# EasyEDA Pro project IMU Module.epro

# Schematic Schematic1
Assembly Variant: Basic; Board Name: Board1; Create Date: 2026-03-11; Page Name: P1; Project Name: arm_angles; Schematic Name: Schematic1; Update Date: 2026-03-11; BladeWidth: 10; Company: 嘉立创EDA; Page Size: A4; RegionStart: 1; ShowBorder: 1; TitleBlock: 1; TitleBlockPosition: 3; Version: V1.0; XRegionCount: 6; YRegionCount: 4
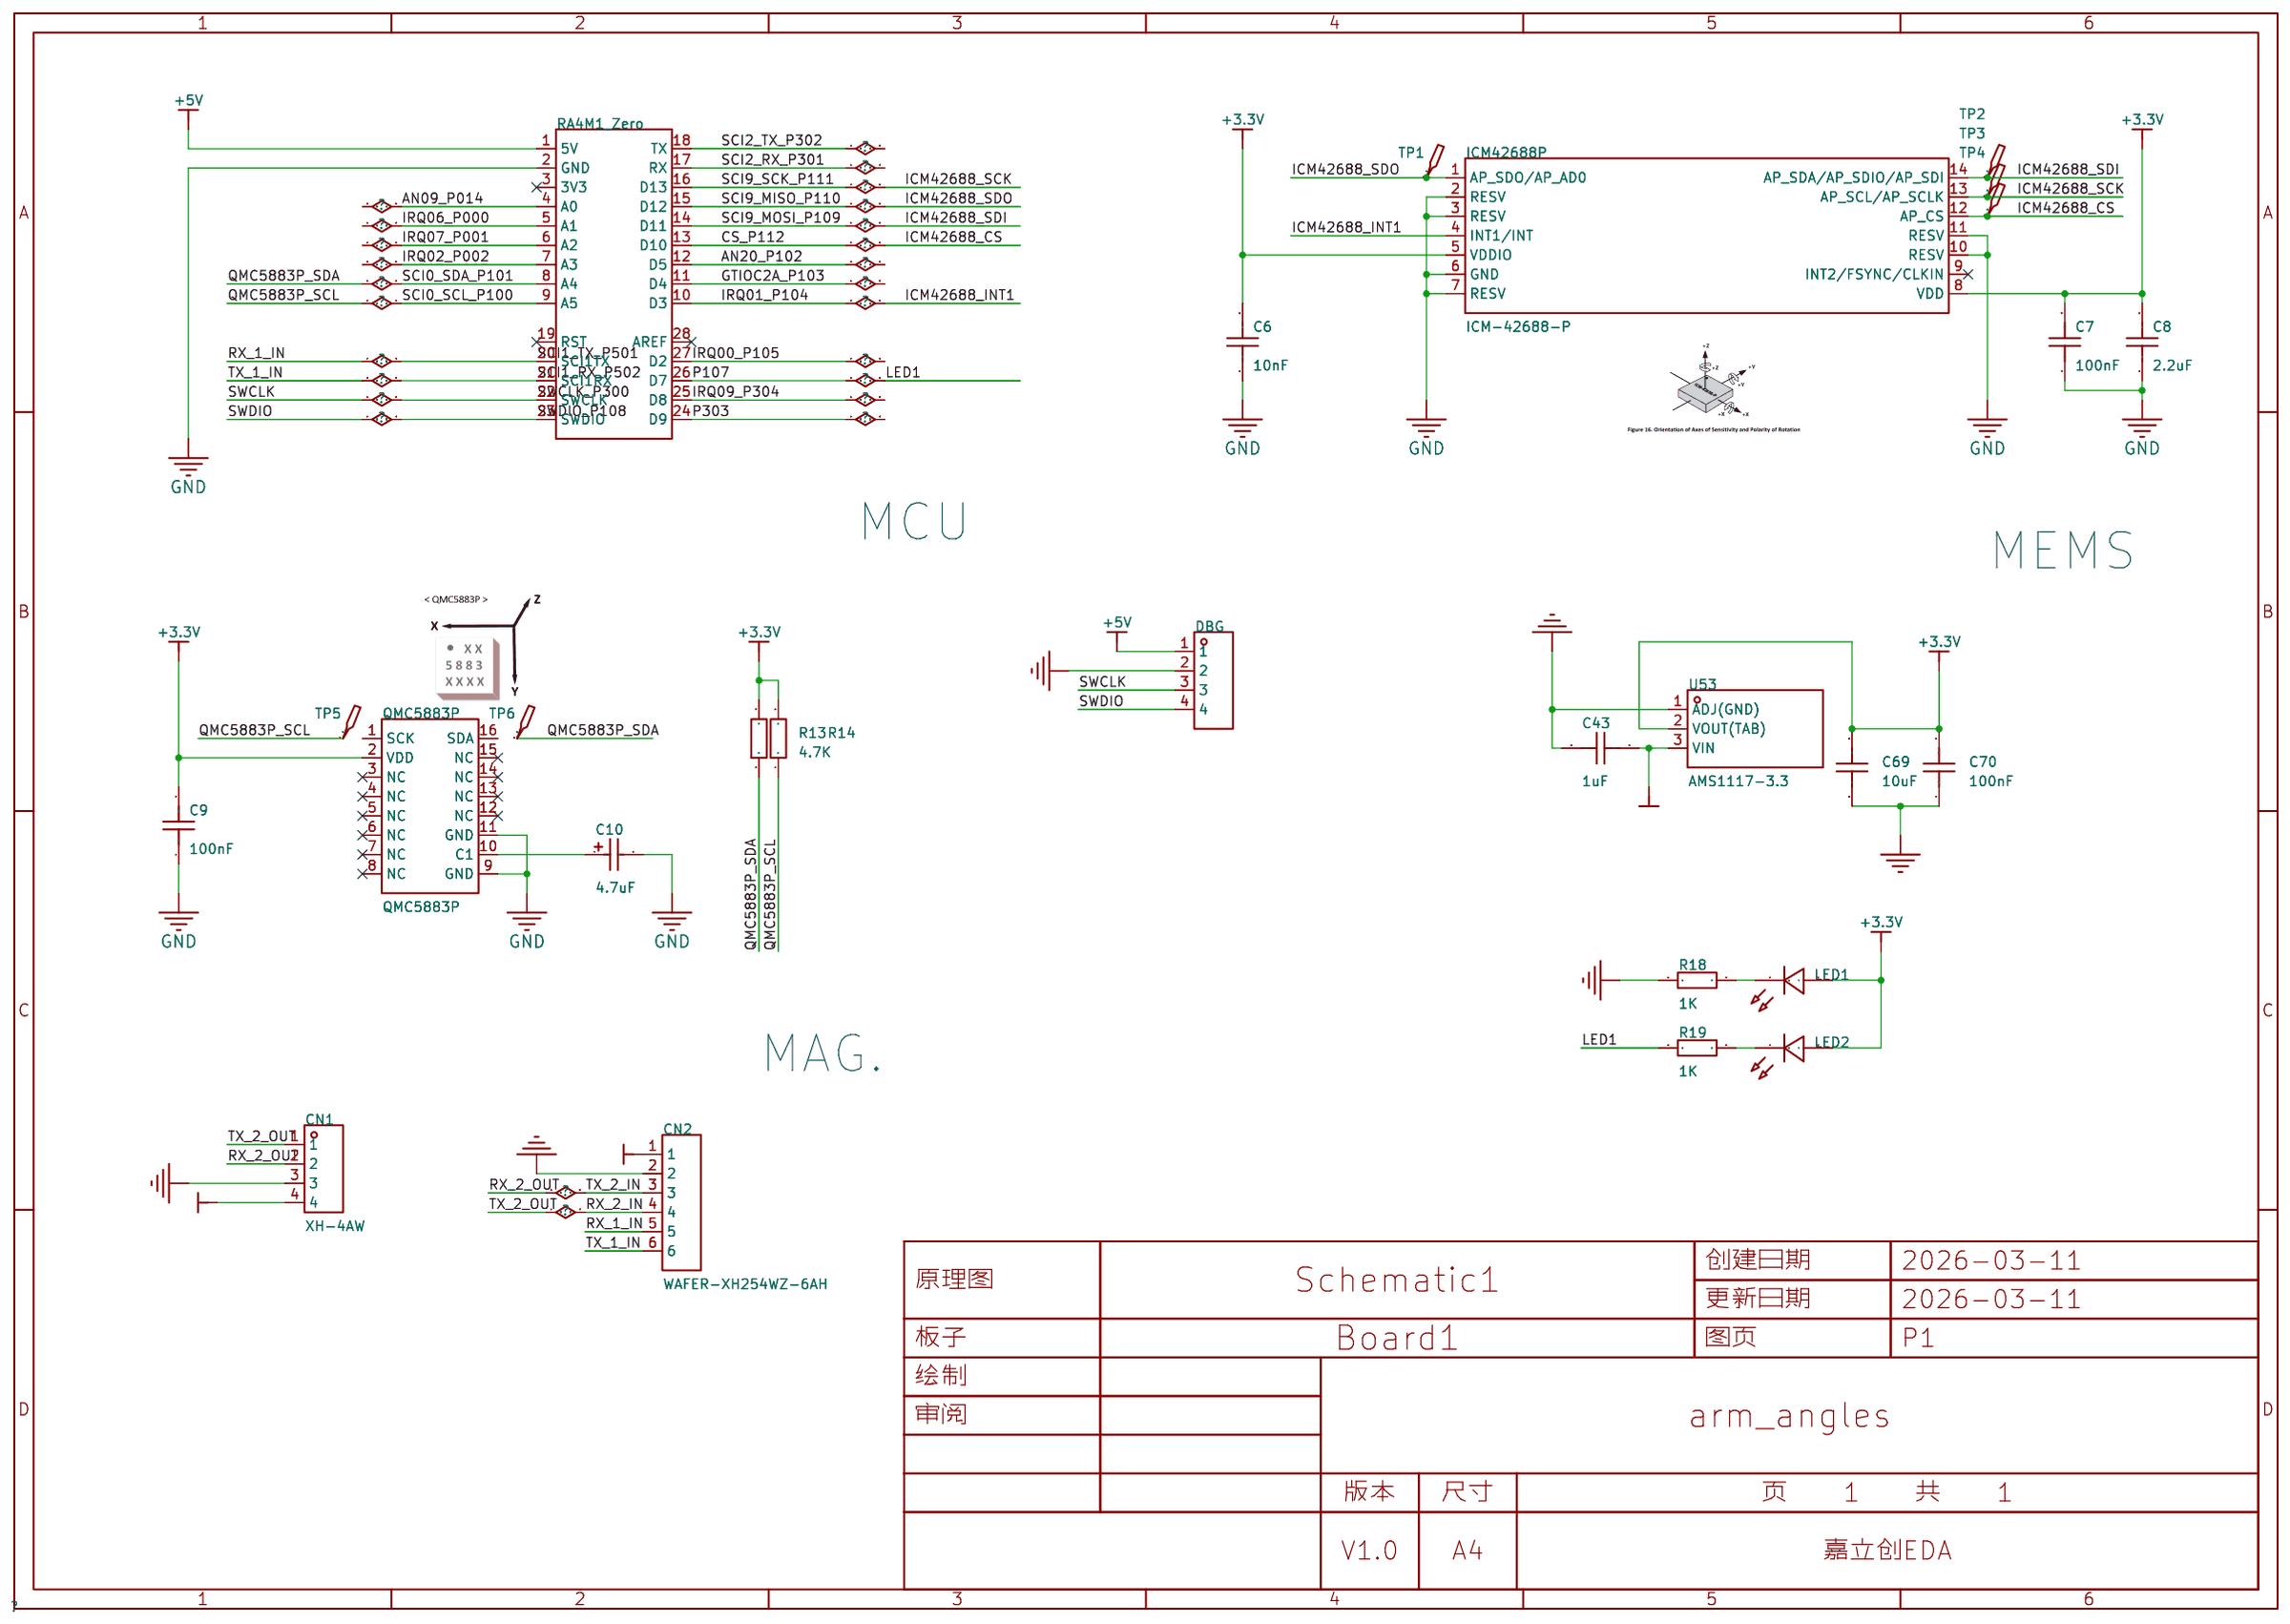
[diagram p0: schematic sheet]

## Parts
C6  10nF  [C0603]
C7  100nF  [C0603]
C8  2.2uF  [C0603]
C9  100nF  [C0603]
C10  4.7uF  [CASE-A_3216]
C43  1uF  [C0603]
C69  10uF  [C0603]
C70  100nF  [C0603]
CN1  XH-4AW  [CONN-TH_XH-4AW]
CN2  WAFER-XH254WZ-6AH  [CONN-TH_6P-P2.50_WAFER-XH254WZ-6A]
DBG  -  [HDR-TH_4P-P2.54-V-F]
ICM42688P  ICM-42688-P  [LGA-14_L3.0-W2.5-P0.50-TL]
LED1  -  [LED0603]
LED2  -  [LED0603]
QMC5883P  QMC5883P  [LGA-16_L3.0-W3.0-P0.50-BL_SQ]
R13  4.7K  [R0603]
R14  4.7K  [R0603]
R18  1K  [R0603]
R19  1K  [R0603]
RA4M1_Zero  -  [RA4M1-Zero]
TP1  -  [Test-Point-0.5mm]
TP2  -  [Test-Point-0.5mm]
TP3  -  [Test-Point-0.5mm]
TP4  -  [Test-Point-0.5mm]
TP5  -  [Test-Point-0.5mm]
TP6  -  [Test-Point-0.5mm]
U53  AMS1117-3.3  [SOT-89_L4.5-W2.5-P1.50-LS4.2-BR]

## Library data of the parts
C6-C9 = C0603: Supplier Footprint: 0603
C10 = TAJA475K016RNJ: 容值:4.7uF;精度:±10%;额定电压:16V;等效串联电阻(ESR):4Ω@100kHz;; LCSC Part Name: 4.7uF ±10% 16V; Supplier Part: C7187; Manufacturer: Kyocera AVX; Supplier Footprint: CASE-A-3216-18(mm); JLCPCB Part Class: 扩展库; Supplier: LCSC; Tolerance: ±10%; Voltage Rating: 16V; Equivalent Series Resistance(ESR): 4Ω@100kHz; Operating Temperature: -55℃~+125℃
C43 = CL10A105KB8NNNC: 容值:1uF;精度:±10%;额定电压:50V;材质(温度系数):X5R;; LCSC Part Name: 1uF ±10% 50V; Supplier Part: C15849; Manufacturer: SAMSUNG(三星); Supplier Footprint: 0603; JLCPCB Part Class: 基础库; Datasheet: https://atta.szlcsc.com/upload/public/pdf/source/20160218/1457707763339.pdf; Supplier: LCSC; Tolerance: ±10%; Voltage Rated: 50V; Temperature Coefficient: X5R
C69 = CGA0603X5R106K100JT: 容值:10uF;精度:±10%;额定电压:10V;材质(温度系数):X5R;; LCSC Part Name: 10uF ±10% 10V; Supplier Part: C6119842; Manufacturer: HRE(芯声); Supplier Footprint: 0603; JLCPCB Part Class: 扩展库; Datasheet: https://item.szlcsc.com/datasheet/CGA0603X5R106K100JT/7062548.html; Supplier: LCSC; Tolerance: ±10%; Voltage Rating: 10V; Temperature Coefficient: X5R; Voltage Rated: 10V
C70 = CC0603KRX7R9BB104: 容值:100nF;精度:±10%;额定电压:50V;材质(温度系数):X7R;; LCSC Part Name: 100nF ±10% 50V; Supplier Part: C14663; Manufacturer: YAGEO(国巨); Supplier Footprint: 0603; JLCPCB Part Class: 基础库; Datasheet: https://atta.szlcsc.com/upload/public/pdf/source/20180910/C282072_33301C7F631E79921B82A8DAC6BCC5B3.pdf; Supplier: LCSC; Tolerance: ±10%; Voltage Rated: 50V; Temperature Coefficient: X7R
CN1 = XH-4AW: 插针结构:1x4P;间距:2.54mm;安装方式:弯插;参考系列:XH;总PIN数:4P;排数:1;每排PIN数:4;行距:-;额定电流:3A;触头材质:黄铜;触头镀层:锡;工作温度:-25℃~+85℃;; LCSC Part Name: 1x4P 间距:2.54mm 弯插 系列:XH; Supplier Part: C2908613; Manufacturer: HCTL(华灿天禄); Supplier Footprint: 弯插,P=2.5mm; JLCPCB Part Class: Extended Part; Datasheet: https://item.szlcsc.com/datasheet/XH-4AW/3184384.html; Supplier: LCSC; Pins Structure: 1x4P; Pitch: 2.54mm; Mounting Type: 弯插; Reference Series: XH; Number of Pins: 4P; Number of Rows: 1; Number of PINs Per Row: 4; Current Rating: 3A; Contact Material: 黄铜; Contact Plating: 锡; Operating Temperature: -25℃~+85℃; Voltage Rating: 250V; Plastic Material: PA66; Flame Retardant Rating: UL94V-0; Z-Height of the Board: 5.9mm; Y-Width of Bottom Edge on Board: 7mm
CN2 = WAFER-XH254WZ-6AH: 插针结构:1x6P;间距:2.54mm;安装方式:弯插;参考系列:XH;总PIN数:6P;排数:1;每排PIN数:6;额定电流:3A;触头材质:黄铜;工作温度:-25℃~+85℃;; LCSC Part Name: 1x6P 间距:2.54mm 弯插 系列:XH; Supplier Part: C22751817; Manufacturer: HANBO(汉博); Supplier Footprint: 弯插,P=2.54mm; JLCPCB Part Class: Extended Part; Datasheet: https://item.szlcsc.com/datasheet/WAFER-XH254WZ-6AH/24478752.html; Supplier: LCSC; Pins Structure: 1x6P; Pitch: 2.54mm; Mounting Type: 弯插; Reference Series: XH; Number of Pins: 6P; Number of Rows: 1; Number of PINs Per Row: 6; Current Rating: 3A; Contact Material: 黄铜; Operating Temperature: -25℃~+85℃; Voltage Rating: 250V; Plastic Material: PA66; Flame Retardant Rating: UL94V-0
DBG = HDR-F_2.54_1x4P: Supplier Part: C2718488; Supplier Footprint: 插件
ICM42688P = ICM-42688-P: 传感器类型:加速度计陀螺仪;; Supplier Part: C1850418; Manufacturer: TDK InvenSense(应美盛); Supplier Footprint: LGA-14(2.5x3); JLCPCB Part Class: 扩展库; Datasheet: https://atta.szlcsc.com/upload/public/pdf/source/20210703/CF24204867ACE5B754A2B035F23E5931.pdf; Supplier: LCSC; Sensor Type: 加速度计陀螺仪
LED1 LED2 = LED0603-WHITE
QMC5883P = QMC5883P: QMC5883L停产，推荐使用 C2847467 QMC5883P替代; LCSC Part Name: 三轴磁传感器; Supplier Part: C2847467; Manufacturer: QST(上海矽睿); Supplier Footprint: LGA-16(3x3); JLCPCB Part Class: 扩展库; Datasheet: https://item.szlcsc.com/datasheet/QMC5883P/3044607.html; Supplier: LCSC
R13 R14 R18 R19 = R0603: Supplier Footprint: 0603
RA4M1_Zero = RA4M1_Zero
TP1-TP6 = Test-Point: Test Point 测试点
U53 = AMS1117-3.3_C347256: 输出类型:固定;工作电压:18V;输出电压:3.3V;输出电流:1A;电源纹波抑制比(PSRR):60dB@(120Hz);输出极性:正极;; LCSC Part Name: 输出:3.3V 电流:1A 耐压:18V; Supplier Part: C347256; Manufacturer: UMW(友台半导体); Supplier Footprint: SOT-89; JLCPCB Part Class: 扩展库; Datasheet: https://atta.szlcsc.com/upload/public/pdf/source/20241218/BAF0263FA2E44BCD8AF41AA4FA04EFAA.pdf; Supplier: LCSC; Output Type: 固定; Voltage - Supply: 18V; Output Voltage: 3.3V; Output Current: 1A; Power Supply Rejection Ratio (PSRR): 60dB@(120Hz); Voltage Dropout: 1.3V@(1A); Features: 过流保护(OCP); Output Configuration: 正极; Number of Outputs: 1

## Nets
+3.3V: C6.2 C7.2 C8.2 C9.2 C69.2 C70.2 ICM42688P.5(VDDIO) ICM42688P.8(VDD) LED1.2(A) LED2.2(A) QMC5883P.2(VDD) R13.2 R14.2 U53.2(VOUT(TAB))
+5V: C43.1 CN1.4 CN2.1 DBG.1 RA4M1_Zero.1(5V) U53.3(VIN)
GND: C6.1 C7.1 C8.1 C9.1 C10.2 C43.2 C69.1 C70.1 CN1.3 CN2.2 DBG.2 ICM42688P.2(RESV) ICM42688P.3(RESV) ICM42688P.6(GND) ICM42688P.7(RESV) ICM42688P.10(RESV) ICM42688P.11(RESV) QMC5883P.9(GND) QMC5883P.11(GND) R18.2 RA4M1_Zero.2(GND) U53.1(ADJ(GND))
AN09_P014: RA4M1_Zero.4(A0)
AN20_P102: RA4M1_Zero.12(D5)
CS_P112: ICM42688P.12(AP_CS) RA4M1_Zero.13(D10) TP4.1
GTIOC2A_P103: RA4M1_Zero.11(D4)
ICM42688_INT1: ICM42688P.4(INT1/INT) RA4M1_Zero.10(D3)
ICM42688_SCK: ICM42688P.13(AP_SCL/AP_SCLK) RA4M1_Zero.16(D13) TP3.1
ICM42688_SDI: ICM42688P.14(AP_SDA/AP_SDIO/AP_SDI) RA4M1_Zero.14(D11) TP2.1
ICM42688_SDO: ICM42688P.1(AP_SDO/AP_AD0) RA4M1_Zero.15(D12) TP1.1
IRQ00_P105: RA4M1_Zero.27(D2)
IRQ02_P002: RA4M1_Zero.7(A3)
IRQ06_P000: RA4M1_Zero.5(A1)
IRQ07_P001: RA4M1_Zero.6(A2)
IRQ09_P304: RA4M1_Zero.25(D8)
LED1: R19.2 RA4M1_Zero.26(D7)
P303: RA4M1_Zero.24(D9)
QMC5883P_SCL: QMC5883P.1(SCK) R13.1 RA4M1_Zero.9(A5) TP5.1
QMC5883P_SDA: QMC5883P.16(SDA) R14.1 RA4M1_Zero.8(A4) TP6.1
RX_1_IN: CN2.5 RA4M1_Zero.20(SCI1TX)
RX_2_IN: CN1.1 CN2.4
RX_2_OUT: CN1.2 CN2.3
SCI1_RX_P502: CN2.6 RA4M1_Zero.21(SCI1RX)
SCI2_RX_P301: RA4M1_Zero.17(RX)
SCI2_TX_P302: RA4M1_Zero.18(TX)
SWCLK: DBG.3 RA4M1_Zero.22(SWCLK)
SWDIO: DBG.4 RA4M1_Zero.23(SWDIO)
$1N317: C10.1 QMC5883P.10(C1)
$1N327: LED1.1(C) R18.1
$1N328: LED2.1(C) R19.1

Not connected (* = marked no-connect by the designer): ICM42688P 9(INT2/FSYNC/CLKIN)*; QMC5883P 3(NC)* 4(NC)* 5(NC)* 6(NC)* 7(NC)* 8(NC)* 12(NC)* 13(NC)* 14(NC)* 15(NC)*; RA4M1_Zero 3(3V3)* 19(RST)* 28(AREF)*

## Notes on the sheet
- MCU
- MEMS
- MAG.

# Board PCB1
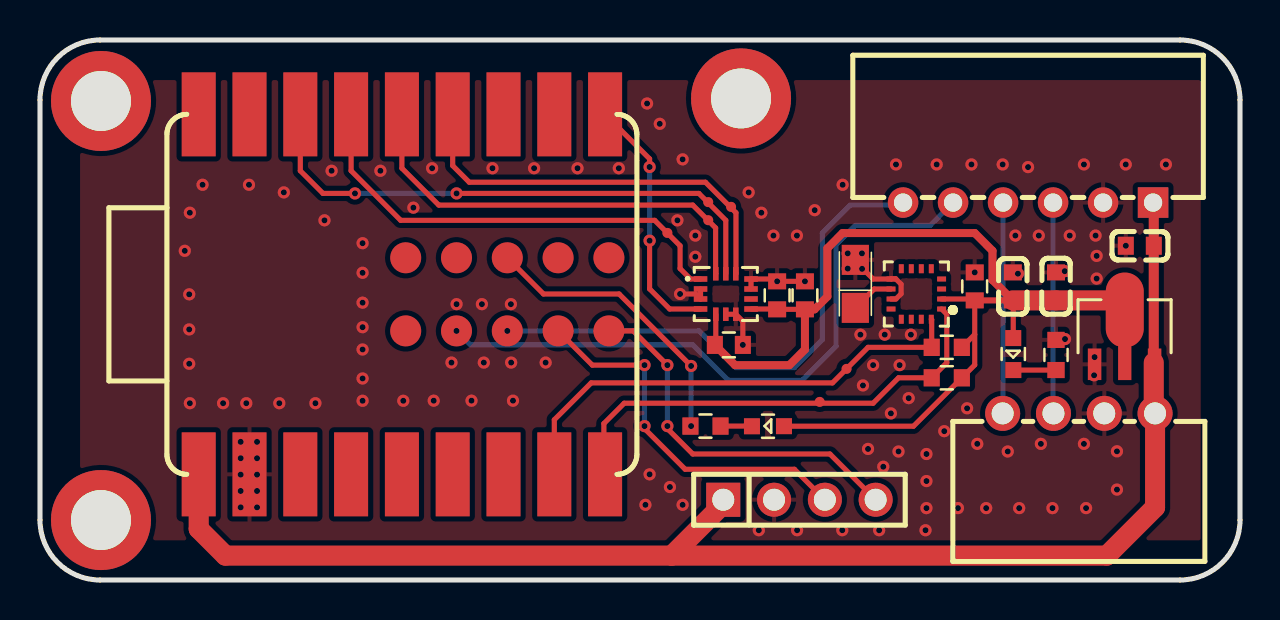
[diagram p1: board, top side]
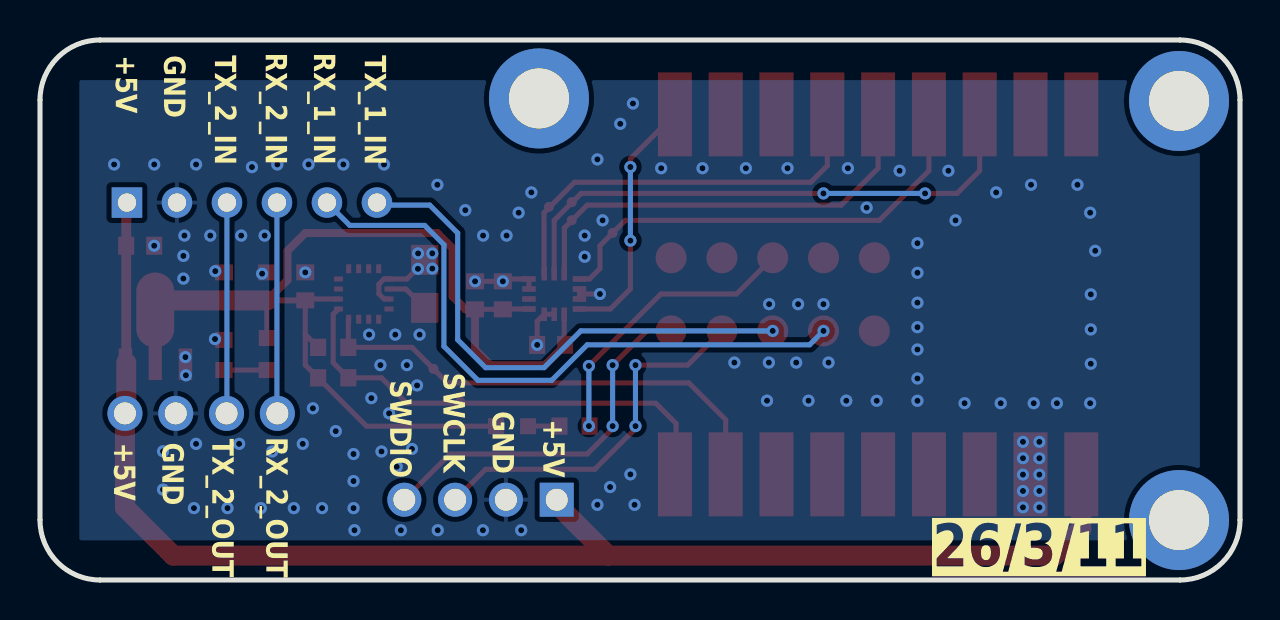
[diagram p2: board, bottom side, seen from below]

Outline 60 x 27 mm; copper layers: Top Layer, Bottom Layer. Coordinates in mm from the lower left corner of the outline.
Outline path: 0,24 0,3 arc(0.88,0.88) 3,0 57,0 arc(59.12,0.88) 60,3 60,24 arc(59.12,26.12) 57,27 3,27 arc(0.88,26.12) 0,24
Stack: Top Layer 0.035mm / Dielectric1 1.51mm FR4 er 4.5 / Bottom Layer 0.035mm

## Design rules (mm)
spacing copperThickness1oz (default): track to track 0.102, other pairs 0.152 to 0.3
spacing copperThickness2oz: track to track 0.203, other pairs 0.152 to 0.3
spacing Plane_innerPlane: track to track 0.102, other pairs 0.152 to 0.3
spacing Copper_copperRegion: track to track 0.102, other pairs 0.152 to 0.3
track width copperThickness1oz (default): min 0.127, default 0.254, max 2.54
track width copperThickness2oz: min 0.203, default 0.254, max 2.54
differential pair differentialPair (default): width min 0.127, default 0.254, max 2.54; gap min 0.152, default 0.152
net GND uses copperRegion_copperThickness1oz
pour e418 uses Copper_copperRegion, copperRegion_Copper_copperRegion
pour e432 uses Copper_copperRegion, copperRegion_Copper_copperRegion

## Placement (name value [footprint] x y rotation side)
C6  10nF  [C0603]  34.44 11.75 180 top
C7  100nF  [C0603]  38.25 14.23 270 top
C8  2.2uF  [C0603]  36.86 14.23 270 top
C9  100nF  [C0603]  46.74 14.68 270 top
C10  4.7uF  [CASE-A_3216]  40.77 14.81 90 top
C43  1uF  [C0603]  54.99 16.71 180 top
C69  10uF  [C0603]  48.64 14.68 270 top
C70  100nF  [C0603]  50.8 14.68 270 top
CN1  XH-4AW  [CONN-TH_XH-4AW]  51.94 8.33 0 top
CN2  WAFER-XH254WZ-6AH  [CONN-TH_6P-P2.50_WAFER-XH254WZ-6A]  49.4 18.87 180 top
DBG  -  [HDR-TH_4P-P2.54-V-F]  37.97 4.01 0 top
ICM42688P  ICM-42688-P  [LGA-14_L3.0-W2.5-P0.50-TL]  34.29 14.3 0 top
LED1  -  [LED0603]  48.66 11.35 90 top
LED2  -  [LED0603]  36.45 7.7 0 top
NOREF  -  [Pad_e405]  3.05 3 0 top
NOREF#2  -  [Pad_e403]  35.05 24.08 0 top
NOREF#3  -  [Pad_e404]  3.05 23.95 0 top
QMC5883P  QMC5883P  [LGA-16_L3.0-W3.0-P0.50-BL_SQ]  43.81 14.3 90 top
R13  4.7K  [R0603]  45.34 10.11 0 top
R14  4.7K  [R0603]  45.34 11.63 0 top
R18  1K  [R0603]  50.8 11.25 90 top
R19  1K  [R0603]  33.27 7.7 180 top
RA4M1_Zero  -  [RA4M1-Zero]  29.84 5.28 90 top
TP1  -  [Test-Point-0.5mm]  31.37 17.36 0 top
TP2  -  [Test-Point-0.5mm]  33.41 17.99 0 top
TP3  -  [Test-Point-0.5mm]  33.41 18.89 0 top
TP4  -  [Test-Point-0.5mm]  34.55 18.66 0 top
TP5  -  [Test-Point-0.5mm]  38.98 8.91 0 top
TP6  -  [Test-Point-0.5mm]  40.33 10.56 0 top
U53  AMS1117-3.3  [SOT-89_L4.5-W2.5-P1.50-LS4.2-BR]  54.23 12.14 270 top

## Footprints (pads in the part's own frame, mm; a bottom-side part is the same pattern mirrored in y, then rotated)
C0603
  rect 0.8x0.9 smd: 1(-0.7,0) 2(0.7,0)
CASE-A_3216
  rect 1.5x1.359 smd: 1(-1.2,0) 2(1.2,0)
CONN-TH_6P-P2.50_WAFER-XH254WZ-6A
  rect 1.524x1.524 hole 0.914: 1(-6.25,0)
  round 1.524 hole 0.914: 2(-3.75,0) 3(-1.25,0) 4(1.25,0) 5(3.75,0) 6(6.25,0)
CONN-TH_XH-4AW
  round 1.75 hole 1.1: 1(-3.81,0) 2(-1.27,0) 3(1.27,0) 4(3.81,0)
HDR-TH_4P-P2.54-V-F
  rect 1.7x1.7 hole 1.1: 1(-3.81,0)
  round 1.7 hole 1.1: 2(-1.27,0) 3(1.27,0) 4(3.81,0)
LED0603
  rect 0.8x0.8 smd: 1(-0.851,-0.01) 2(0.75,-0.005)
LGA-14_L3.0-W2.5-P0.50-TL
  rect 0.675x0.28 smd: 1(-1.262,0.75) 2(-1.262,0.25) 3(-1.262,-0.25) 4(-1.262,-0.75) 8(1.262,-0.75) 9(1.262,-0.25) 10(1.262,0.25) 11(1.262,0.75)
  rect 0.28x0.675 smd: 5(-0.5,-1.012) 6(0,-1.012) 7(0.5,-1.012) 12(0.5,1.012) 13(0,1.012) 14(-0.5,1.012)
LGA-16_L3.0-W3.0-P0.50-BL_SQ
  rect 0.25x0.45 smd: 1(-0.75,-1.263) 2(-0.25,-1.263) 3(0.25,-1.263) 4(0.75,-1.263) 9(0.75,1.263) 10(0.25,1.263) 11(-0.25,1.263) 12(-0.75,1.263)
  rect 0.45x0.25 smd: 5(1.263,-0.75) 6(1.263,-0.25) 7(1.263,0.25) 8(1.263,0.75) 13(-1.263,0.75) 14(-1.263,0.25) 15(-1.263,-0.25) 16(-1.263,-0.75)
Pad_e403
  round 5 hole 3: 1(0,0)
Pad_e404
  round 5 hole 3: 1(0,0)
Pad_e405
  round 5 hole 3: 1(0,0)
R0603
  rect 0.806x0.864 smd: 1(-0.753,0) 2(0.753,0)
RA4M1-Zero
  rect 4.2x1.7 smd: 1(0,21.91) 2(0,19.37) 3(0,16.83) 4(0,14.29) 5(0,11.75) 6(0,9.21) 7(0,6.67) 8(0,4.13) 9(0,1.59) 10(18,1.59) 11(18,4.13) 12(18,6.67) 13(18,9.21) 14(18,11.75) 15(18,14.29) 16(18,16.83) 17(18,19.37) 18(18,21.91)
  round 1.55 smd: 19(7.172,11.56) 20(7.172,9.02) 21(7.172,6.48) 22(7.172,3.94) 23(7.172,1.4) 24(10.828,1.4) 25(10.828,3.94) 26(10.828,6.48) 27(10.828,9.02) 28(10.828,11.56)
SOT-89_L4.5-W2.5-P1.50-LS4.2-BR
  rect 1.575x0.672 smd: 1(1.356,-1.5) 3(1.356,1.5)
  custom 5.377x1.9 smd: 2(-1.356,0.009)
Test-Point-0.5mm
  round 0.5 smd: 1(0,0)

## Nets
As in the schematic.

Pads without a net: ICM42688P 9; NOREF 1; NOREF#2 1; NOREF#3 1; QMC5883P 3 4 5 6 7 8 12 13 14 15; RA4M1_Zero 3 19 28

## Via types
v1: diameter 0.61, hole 0.305, Top Layer to Bottom Layer, 139 vias

## Routing (per net, layer and track width the routed paths; a pad name or vN(x,y) marks a point on that pad's centre or on a via; arc(x,y) is an arc through that point)
+3.3V: length 54.6
  Top Layer w0.254: LED2.2 43.67,7.69 R13.2 46.74,10.75 46.74,12.28 ; 46.74,12.28 C9.2 46.67,14.05 QMC5883P.2 ; 46.74,12.28 R14.2 ; ICM42688P.5 33.79,11.8 C6.2 ; C7.2 C8.2 36.84,13.55 ICM42688P.8 ; 48.66,13.96 LED1.2
  Top Layer w0.3: C69.2 C9.2
  Top Layer w0.4: C6.2 34.75,10.74 37.47,10.74 38.25,11.53 C7.2 38.73,13.53 39.37,14.17 39.37,16.59 40.13,17.35 46.74,17.35 47.62,16.46 47.62,15 C69.2 ; U53.2 54.24,14.8
  Top Layer w1: C69.2 C70.2 53.75,13.98 U53.2
+5V: length 71.2
  Top Layer w0.5: 55.69,10.87 55.69,18.84
  Top Layer w1: 55.69,10.87 55.69,8.4 CN1.4 55.75,3.63 53.34,1.22 31.59,1.22 ; 55.69,18.84 CN2.1 ; 31.59,1.22 9.27,1.22 7.94,2.56 RA4M1_Zero.1 ; 31.59,1.22 34.25,3.89
GND: length 11
  Top Layer w0.254: v1(32,14.3) 32.78,14.3 ICM42688P.3 ICM42688P.2 ; v1(35.14,11.75) 35.14,12.94 ICM42688P.7 ICM42688P.6 ; v1(38.25,14.93) v1(36.86,14.93) 36.74,15.05 ICM42688P.11 ICM42688P.10 ; C10.2 40.77,15.94 41.66,15.05 QMC5883P.9 42.56,15.06 42.78,15.06 43.06,14.79 43.06,14.31 42.8,14.05 QMC5883P.11
  vias: v1(7.24,16.46) v1(7.49,18.36) v1(7.46,14.28) v1(7.46,12.53) v1(7.46,10.81) v1(7.49,8.84) v1(8.13,19.76) v1(9.16,8.84) v1(10.03,6.91) v1(10.03,6.09) v1(10.03,5.27) v1(10.03,4.45) v1(10.03,3.63) v1(10.31,8.84) v1(10.45,19.76) v1(10.85,6.91) v1(10.85,6.09) v1(10.85,5.27) v1(10.85,4.45) v1(10.85,3.63) v1(11.96,8.84) v1(12.19,19.38) v1(13.77,8.84) v1(14.22,17.98) v1(14.58,20.46) v1(16.13,16.84) v1(16.13,15.36) v1(16.13,13.87) v1(16.13,12.64) v1(16.13,11.53) v1(16.13,10.08) v1(16.13,8.96) v1(17.02,20.46) v1(18.16,8.96) v1(18.67,18.62) v1(19.61,20.59) v1(19.69,8.97) v1(20.57,10.87) v1(20.83,13.79) v1(21.58,8.97) v1(22.09,13.79) v1(22.19,10.87) v1(22.62,20.59) v1(23.54,13.79) v1(23.56,10.87) v1(23.65,8.97) v1(24.71,20.59) v1(25.28,10.87) v1(26.88,20.59) v1(28.94,20.59) v1(30.27,3.76) v1(30.35,23.83) v1(30.48,5.28) v1(30.99,22.81) v1(31.5,4.65) v1(31.87,17.98) v1(32.13,21.03) v1(32.13,3.76) v1(32.77,17.22) v1(32.77,16.16) v1(35.43,19.38) v1(35.94,2.49) v1(36.07,18.36) v1(36.67,17.22) v1(37.85,17.22) v1(37.85,2.49) v1(38.74,18.49) v1(40.13,19.76) v1(40.11,2.49) v1(40.39,16.33) v1(40.39,15.57) v1(41.02,12.27) v1(41.1,16.33) v1(41.1,15.56) v1(41.15,9.73) v1(41.4,6.55) v1(41.66,10.74) v1(41.96,2.49) v1(42.24,12.27) v1(42.16,5.66) v1(42.54,8.33) v1(42.8,20.78) v1(42.93,6.43) v1(42.98,10.74) v1(43.43,9.09) v1(43.54,12.27) v1(44.32,6.3) v1(44.32,4.95) v1(44.32,3.59) v1(44.28,2.49) v1(44.83,20.78) v1(45.21,7.44) v1(45.9,3.59) v1(46.35,8.58) v1(46.57,20.78) v1(46.74,15.38) v1(46.86,6.81) v1(47.31,3.59) v1(48.13,20.78) v1(48.39,6.43) v1(48.77,17.22) v1(48.9,15.32) v1(48.96,3.59) v1(49.4,20.65) v1(49.94,17.22) v1(50.04,6.81) v1(50.62,3.59) v1(51.24,15.44) v1(51.25,12.05) v1(51.49,17.22) v1(52.2,20.78) v1(52.2,6.81) v1(52.3,3.59) v1(52.73,11.14) v1(52.71,10.24) v1(52.78,17.22) v1(52.83,16.2) v1(52.83,15.07) v1(53.85,6.43) v1(53.85,4.52) v1(54.29,20.78) v1(54.29,16.71) v1(56.29,20.78)
CS_P112: length 20.8
  Top Layer w0.254: ICM42688P.12 34.8,15.32 34.8,18.36 33.27,19.89 21.46,19.89 20.63,20.72 RA4M1_Zero.13
ICM42688_INT1: length 12.6
  Top Layer w0.254: RA4M1_Zero.10 30.48,21.06 v1(30.48,20.65) ; ICM42688P.4 31.48,13.55 30.48,14.55 v1(30.48,16.97)
  Bottom Layer w0.254: v1(30.48,16.97) v1(30.48,20.65)
ICM42688_SCK: length 27.8
  Top Layer w0.254: RA4M1_Zero.16 13.01,20.46 14.15,19.33 v1(15.75,19.33) ; v1(20.83,19.33) 32.94,19.33 34.29,17.98 ICM42688P.13
  Bottom Layer w0.254: v1(20.83,19.33) v1(15.75,19.33)
ICM42688_SDI: length 21.9
  Top Layer w0.254: ICM42688P.14 33.78,15.32 33.78,17.6 32.64,18.75 19.94,18.75 18.09,20.59 RA4M1_Zero.14
ICM42688_SDO: length 23.2
  Top Layer w0.254: ICM42688P.1 32.52,15.05 32,15.57 32,16.71 30.73,17.98 18.03,17.98 15.56,20.46 RA4M1_Zero.15
LED1: length 14.4
  Top Layer w0.254: v1(32.56,10.7) 28.96,14.3 25.18,14.3 RA4M1_Zero.26
  Bottom Layer w0.254: v1(32.56,10.7) v1(32.56,7.7)
QMC5883P_SCL: length 23.8
  Top Layer w0.254: QMC5883P.1 45.34,13.29 45.34,10.86 R13.1 42.93,10.11 41.66,8.84 29.21,8.84 28.19,7.82 28.19,5.34 RA4M1_Zero.9
QMC5883P_SDA: length 24.5
  Top Layer w0.254: RA4M1_Zero.8 25.72,8.01 27.56,9.86 39.62,9.86 41.4,11.63 R14.1 44.59,13.02 QMC5883P.16
RX_1_IN: length 32.5
  Bottom Layer w0.254: v1(20.82,12.45) 21.52,11.76 32.64,11.76 34.42,9.98 38.1,9.98 39.8,11.68 39.8,16.76 40.77,17.73 44.51,17.73 CN2.5
RX_2_IN: length 10.5
  Bottom Layer w0.254: CN2.4 48.15,8.35 CN1.1
RX_2_OUT: length 10.5
  Bottom Layer w0.254: CN1.2 50.65,8.35 CN2.3
SCI1_RX_P502: length 27.1
  Bottom Layer w0.254: CN2.6 43.03,18.75 40.51,18.75 39.12,17.35 39.12,12.01 37.72,10.62 34.8,10.62 32.96,12.45 v1(23.37,12.45)
SWCLK: length 18.7
  Top Layer w0.254: v1(30.23,10.74) 27.62,10.74 RA4M1_Zero.22 ; DBG.3 37.72,5.54 32.26,5.54 30.23,7.57 v1(30.23,7.7)
  Bottom Layer w0.254: v1(30.23,10.74) v1(30.23,7.7)
SWDIO: length 18.7
  Top Layer w0.254: v1(31.37,10.74) 29.66,12.45 RA4M1_Zero.23 ; v1(31.37,7.7) 31.37,7.57 32.64,6.3 39.5,6.3 DBG.4
  Bottom Layer w0.254: v1(31.37,10.74) v1(31.37,7.7)
$1N317: length 2.2
  Top Layer w0.254: QMC5883P.10 41.71,14.55 C10.1
$1N327: length 2.1
  Top Layer w0.254: LED1.1 50.8,10.5 R18.1
$1N328: length 1.6
  Top Layer w0.254: R19.1 35.59,7.7 LED2.1

## Copper pours and planes (outline as drawn; the poured copper is in the pictures)
GND on Top Layer: 0,27 60.07,27 60.07,-0.02 0,-0.02
GND on Bottom Layer: 0,27 60.07,27 60.07,-0.02 0,-0.02

## Text on the board
Bottom Silkscreen Layer: +5V | GND | SWCLK | SWDIO | TX_1_IN | RX_1_IN | RX_2_OUT | RX_2_IN | TX_2_IN | TX_2_OUT | 26/3/11
